# Altium project v5-IRarray.PrjPcb
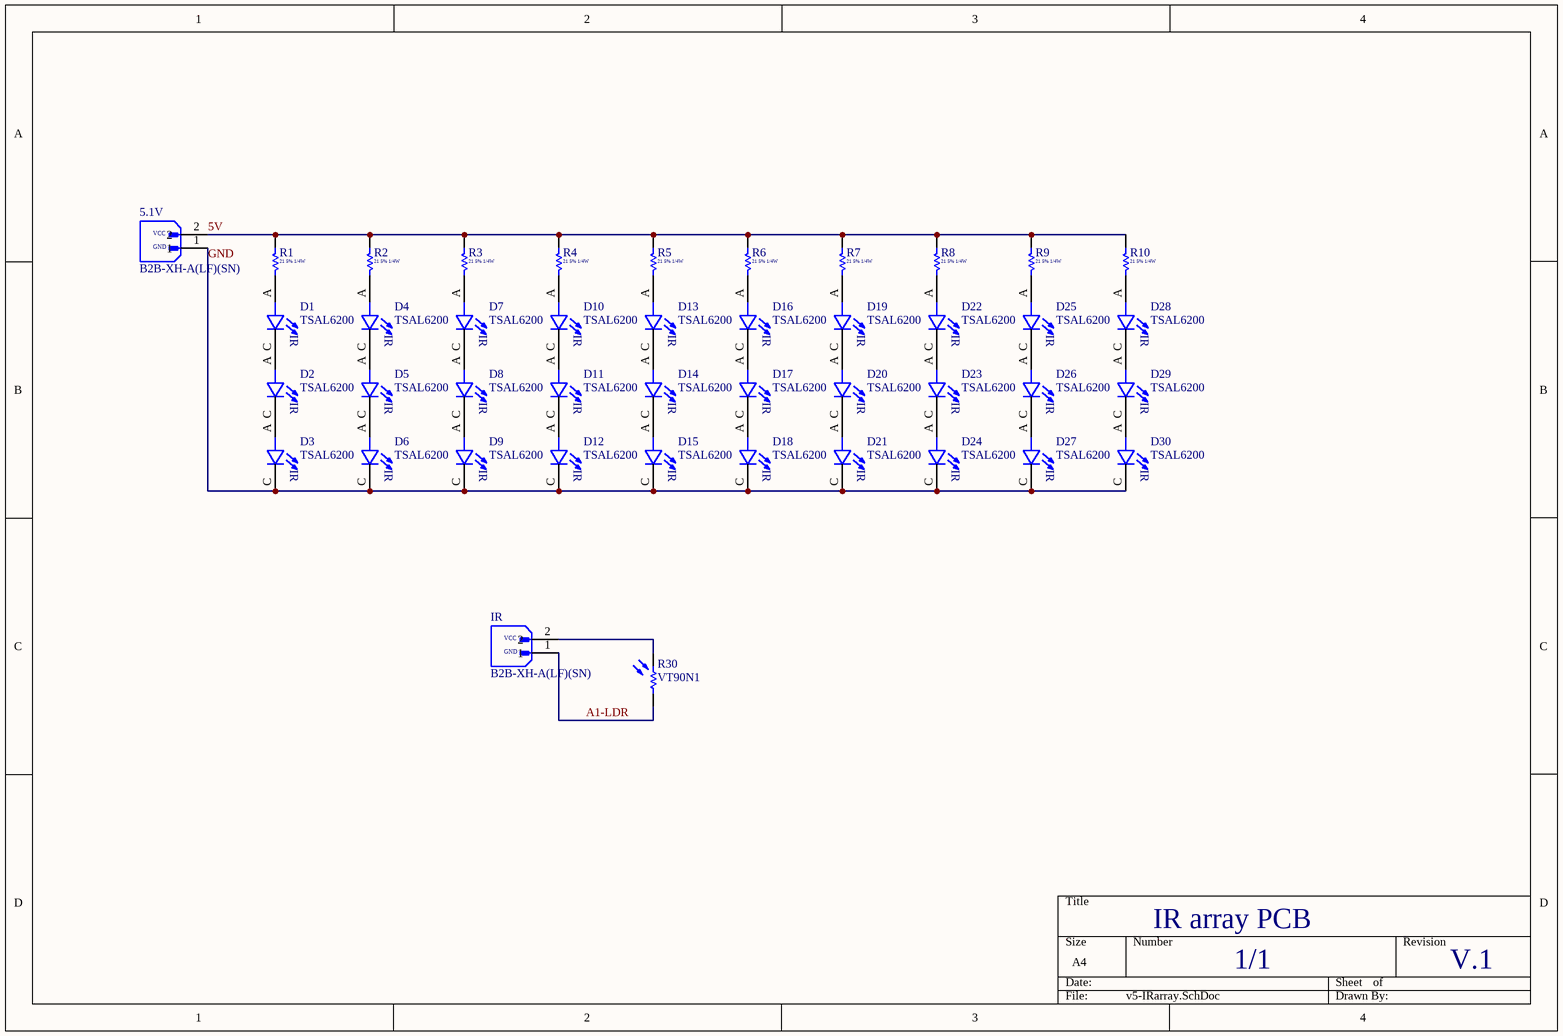
[diagram p0: v5-IRarray.SchDoc]
1 sheet, 43 parts. Net scope: global (net labels, ports and power ports of the same name join across sheets).
Board file: v5-IRarray.pcbdoc

## Sheet v5-IRarray.SchDoc
size A4; SheetNumber: 1; SheetTotal: 1

### Parts
5.1V  B2B-XH-A(LF)(SN)  [JST_B2B-XH-A(LF)(SN)]
D1  TSAL6200  [SFH45547]
D2  TSAL6200  [SFH45547]
D3  TSAL6200  [SFH45547]
D4  TSAL6200  [SFH45547]
D5  TSAL6200  [SFH45547]
D6  TSAL6200  [SFH45547]
D7  TSAL6200  [SFH45547]
D8  TSAL6200  [SFH45547]
D9  TSAL6200  [SFH45547]
D10  TSAL6200  [SFH45547]
D11  TSAL6200  [SFH45547]
D12  TSAL6200  [SFH45547]
D13  TSAL6200  [SFH45547]
D14  TSAL6200  [SFH45547]
D15  TSAL6200  [SFH45547]
D16  TSAL6200  [SFH45547]
D17  TSAL6200  [SFH45547]
D18  TSAL6200  [SFH45547]
D19  TSAL6200  [SFH45547]
D20  TSAL6200  [SFH45547]
D21  TSAL6200  [SFH45547]
D22  TSAL6200  [SFH45547]
D23  TSAL6200  [SFH45547]
D24  TSAL6200  [SFH45547]
D25  TSAL6200  [SFH45547]
D26  TSAL6200  [SFH45547]
D27  TSAL6200  [SFH45547]
D28  TSAL6200  [SFH45547]
D29  TSAL6200  [SFH45547]
D30  TSAL6200  [SFH45547]
IR  B2B-XH-A(LF)(SN)  [JST_B2B-XH-A(LF)(SN)]
R1  21 5% 1/4W  [R1206]
R2  21 5% 1/4W  [R1206]
R3  21 5% 1/4W  [R1206]
R4  21 5% 1/4W  [R1206]
R5  21 5% 1/4W  [R1206]
R6  21 5% 1/4W  [R1206]
R7  21 5% 1/4W  [R1206]
R8  21 5% 1/4W  [R1206]
R9  21 5% 1/4W  [R1206]
R10  21 5% 1/4W  [R1206]
R30  VT90N1  [EXCE-VT90N1]

### Nets
5V: 5.1V.2 R1.1 R2.1 R3.1 R4.1 R5.1 R6.1 R7.1 R8.1 R9.1 R10.1
A1-LDR: IR.1 R30.1
GND: 5.1V.1 D3.C D6.C D9.C D12.C D15.C D18.C D21.C D24.C D27.C D30.C
NetD1_A: D1.A R1.2
NetD1_C: D1.C D2.A
NetD2_C: D2.C D3.A
NetD4_A: D4.A R2.2
NetD4_C: D4.C D5.A
NetD5_C: D5.C D6.A
NetD7_A: D7.A R3.2
NetD7_C: D7.C D8.A
NetD8_C: D8.C D9.A
NetD10_A: D10.A R4.2
NetD10_C: D10.C D11.A
NetD11_C: D11.C D12.A
NetD13_A: D13.A R5.2
NetD13_C: D13.C D14.A
NetD14_C: D14.C D15.A
NetD16_A: D16.A R6.2
NetD16_C: D16.C D17.A
NetD17_C: D17.C D18.A
NetD19_A: D19.A R7.2
NetD19_C: D19.C D20.A
NetD20_C: D20.C D21.A
NetD22_A: D22.A R8.2
NetD22_C: D22.C D23.A
NetD23_C: D23.C D24.A
NetD25_A: D25.A R9.2
NetD25_C: D25.C D26.A
NetD26_C: D26.C D27.A
NetD28_A: D28.A R10.2
NetD28_C: D28.C D29.A
NetD29_C: D29.C D30.A
NetIR_2: IR.2 R30.2

### Notes on the sheet
- IR array PCB
- 1/1
- V.1
- (in symbol B2B-XH-A(LF)(SN)) VCC; GND
- (in symbol SFH4547) IR

### Library data of the parts
5.1V IR = B2B-XH-A(LF)(SN): Connector Header Through Hole 2 position 0.098 (2.50mm); MF: JST Sales America Inc.; SnapEDA_Link: https://www.snapeda.com/parts/B2B-XH-A(LF)(SN)/JST+Sales+America+Inc./view-part/?ref=snap; Package: None; Value: *; MP: B2B-XH-A(LF)(SN); Check_prices: https://www.snapeda.com/parts/B2B-XH-A(LF)(SN)/JST+Sales+America+Inc./view-part/?ref=eda
D1-D30 = SFH4547
R1-R10 = R-1206: SMD 1206 0.25W 5% 200V; Type: RES; Value: 21 5% 1/4W
R30 = CMP-2000-07406-1: Photoconductive Resistor, 200 kOhm, 100 V, 80 mW, -40 to 75 degC, 2-Pin THD, RoHS; Manufacturer: Excelitas Technology; SVHC: Cadmiumchloride(15-Jun-2015); Power Rating: 80mW; Resistance @ Lux: 12kohm; Voltage Rating: 100V; Product Range: -; Datasheet Version: 09/2006; Resistor Case Style: -; Operating Temperature Max: 75°C; Package Reference: VT90N1; Datasheet URL: http://datasheet.octopart.com/VT90N1-Excelitas-datasheet-10388451.pdf; Mounting Technology: ThroughHole; Operating Temperature Min: -40°C; Dark Resistance: 200kohm; Package Description: 2-Pin Through Hole Device, Body Width 4.17 mm (Max), Height 2.29 mm; Manufacturer URL: http://www.excelitas.com/Pages/Index.aspx; Packaging: Each